# Altium schematic sheet PAGE 01-ToC.SchDoc
size 416 x 264 mm; DocumentNumber: 1; SheetNumber: 1; PageSetup: Record=PageOptions|CenterHorizontal=True|CenterVertical=True|PrintScale=1.02|XCorrection=1.00|YCorrection=1.00|PrintKind=0|BorderSize=5000000|LeftOffset=0|BottomOffset=0|Orientation=2|PaperLength=1000|PaperWidth=1000|Scale=100|PaperSource=15|PrintQuality=600|MediaType=1|DitherType=10|PrintScaleMode=1|PaperKind=11x17|PaperIndex=17; Designer: Xuelu Li; DocumentFullPathAndName: //depot_np_hweng_boards/ung_hweng/UNG_8017_EVB-USB5926/
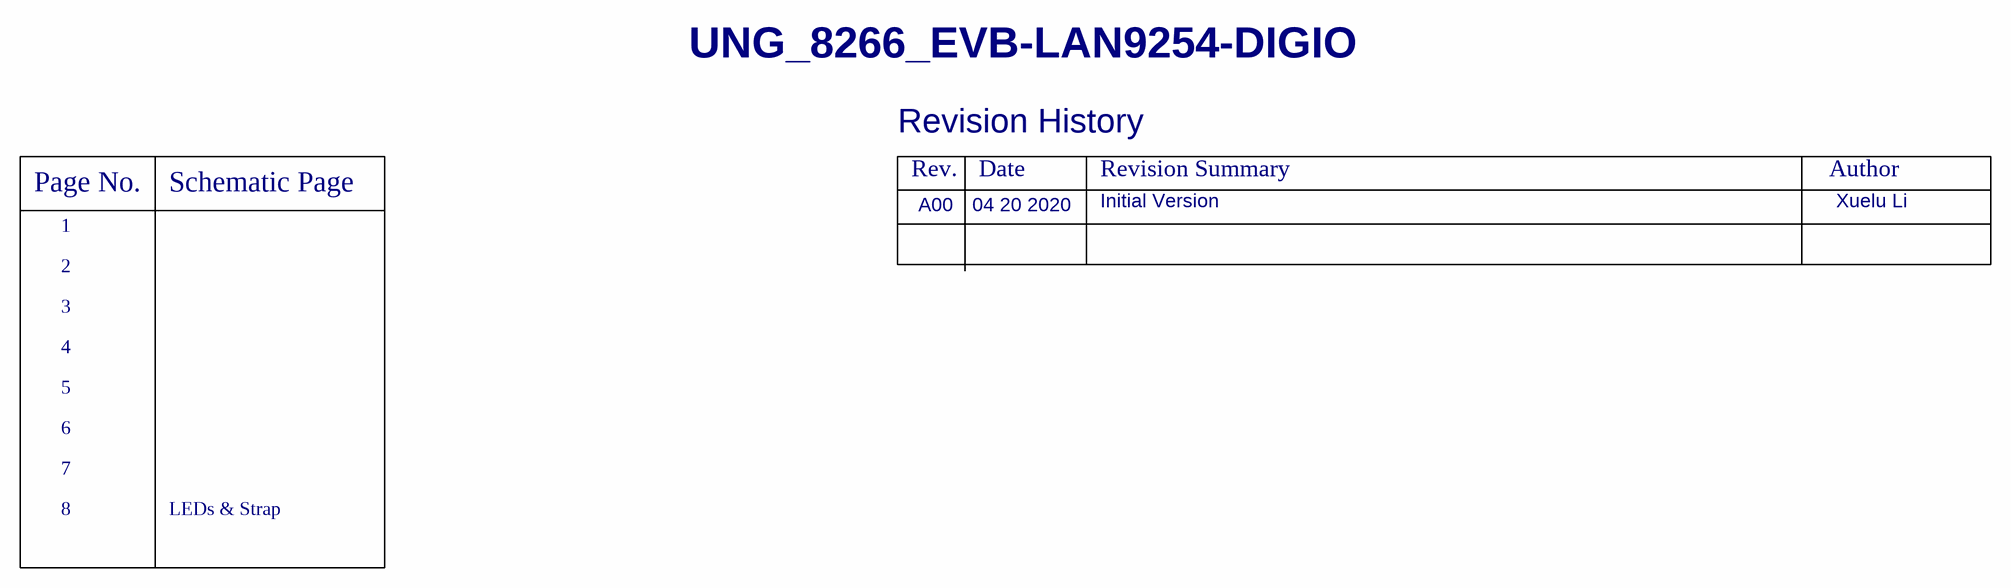
[diagram p0: PAGE 01-ToC.SchDoc]

## Parts
?  (no value)  (graphical)

## Notes on the sheet
- UNG_8266_EVB-LAN9254-DIGIO
- Revision History
- Rev.
- Date
- Revision Summary
- Author
- Page No.
- 1
- Schematic Page
- A00
- 04 20 2020
- Initial Version
- Xuelu Li
- 2
- 3
- 4
- 5
- 6
- 7
- 8
- LEDs & Strap
- Microchip Technology, Inc.
  USB/Network Group - UNG
  www.Microchip.com
- Designed with
- Altium.com <http://go.altium.com/MicrochipLandingPage_Evaluation.html>
- Page Title:
- Project Name:
- Description:
- PN:
- Size:
- B
- Date:
- Designer:
- Sheet
- of
- Rev

## Library data of the parts
? = Title Block B_UNG1_Altium